# Altium schematic sheet BTN2_FactoryReset.SchDoc
size A4; DocumentNumber: 13; SheetNumber: 13; SheetTotal: 16
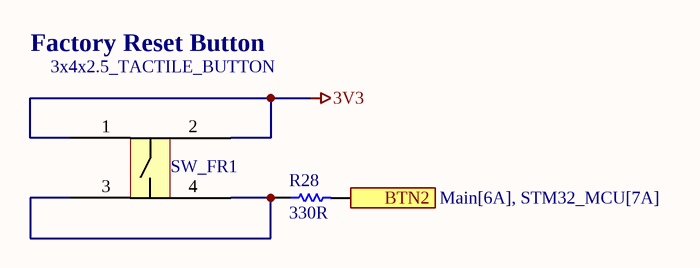
[diagram p0: BTN2_FactoryReset.SchDoc]

## Parts
R28  330R  [RESC1608X55X30LL15T15]
SW_FR1  3x4x2.5_TACTILE_BUTTON  [3x4x2.5_TACTILE_BUTTON]

## Ports
BTN2 (out, see Main[6A], STM32_MCU[7A])

## Nets
3V3: SW_FR1.1 SW_FR1.2
BTN2: R28.2 ; port BTN2
NetR28_1: R28.1 SW_FR1.3 SW_FR1.4

## Notes on the sheet
- Factory Reset Button

## Library data of the parts
R28 = CMP-2000-00435-2: Chip Resistor, 330 Ohm, +/- 1%, 0.1 W, -55 to 155 degC, 0603 (1608 Metric), RoHS, Tape and Reel; Gender: Male; Mating Cycles: 10000; Current Rating: 500 mA; Voltage Rating: 10 V; REACH SVHC: No SVHC; PackageDescription: 2-Pin Surface Mount Device, Body 1.6 x 0.85 mm; Contact Finish: Gold; Pins: 8; ComponentLink1Description: Manufacturer URL; Packaging: Tape and Reel; Max Operating Temperature: 85 degC; Contact Material: Copper; Height: 1.45 mm; Width: 1.45 mm; DatasheetVersion: Apr-15; Package Quantity: 1500; Contact Plating: Gold; PackageReference: 0603; Mount: Surface Mount; Lead Pitch: 1.1 mm; Min Operating Temperature: -25 degC; ComponentLink1URL: http://www.panasonic.com/; ComponentLink2URL: http://industrial.panasonic.com/cdbs/www-data/pdf/RDA0000/AOA0000C86.pdf; Length: 13.7 mm; ComponentLink2Description: Datasheet; RoHSCompliant: true